# Altium schematic sheet 22_USB_CONNECTOR.SchDoc: USB-C Connector
size A; DocumentNumber: 11; SheetNumber: 11; SheetTotal: 12
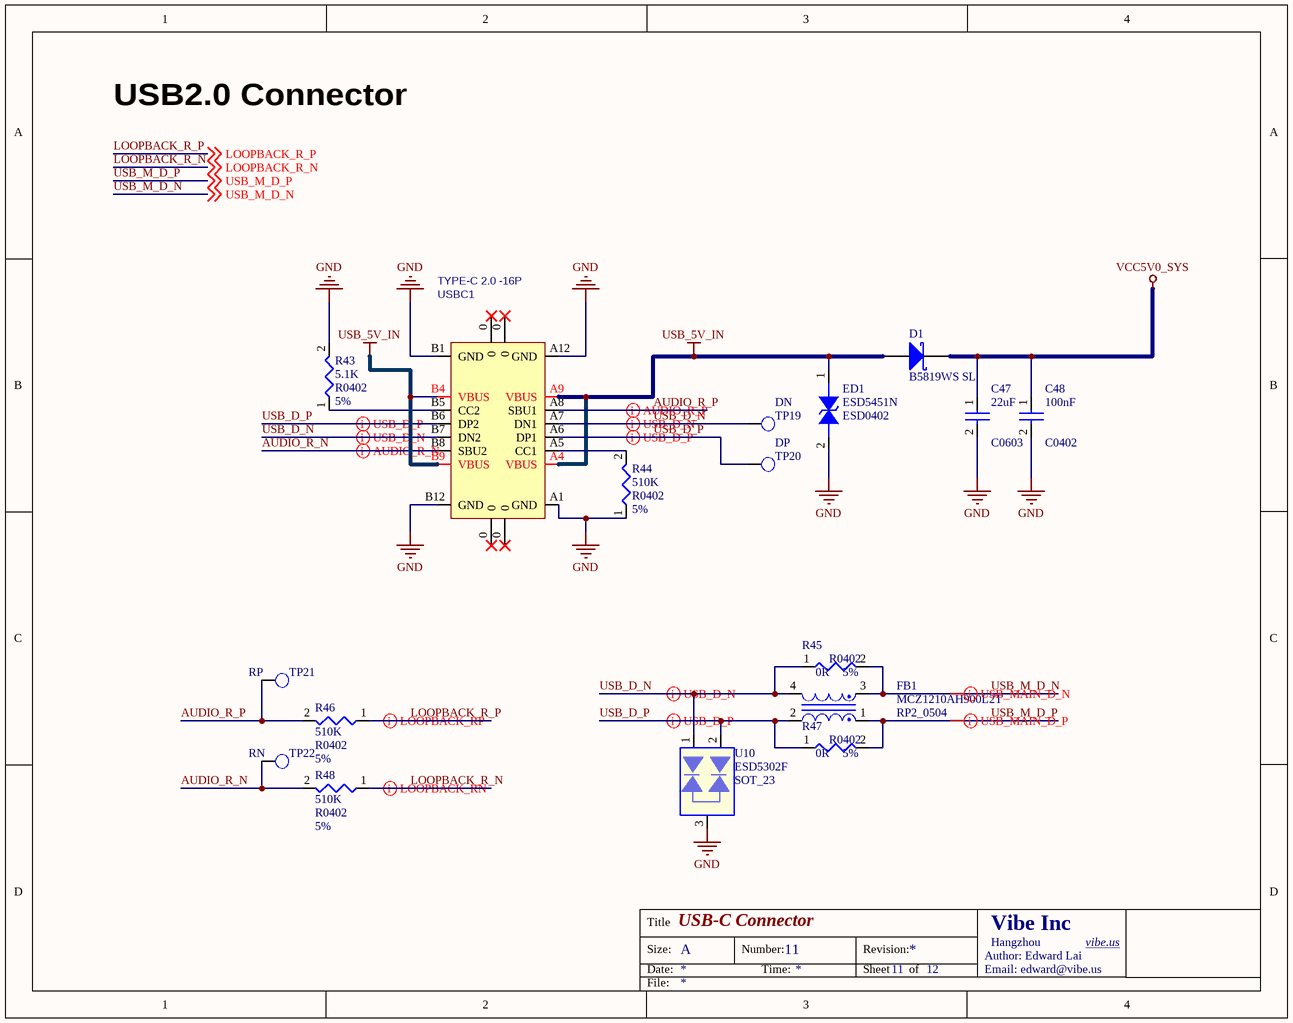
[diagram p0: 22_USB_CONNECTOR.SchDoc]

## Parts
C47  22uF  PCB Footprint: C0603  [C0603_L]
C48  100nF  PCB Footprint: C0402  [C0402_L]
D1  B5819WS SL  [SOD-323]
ED1  ESD5451N  [ESD0402]
FB1  MCZ1210AH900L2T  PCB Footprint: RP2_0504  [L0402D]  (net tie, no BOM)
R43  5.1K  Tolerance: 5%  [R0402]
R44  510K  Tolerance: 5%  [R0402]
R45  0R  Tolerance: 5%  [R0402]
R46  510K  Tolerance: 5%  [R0402]
R47  0R  Tolerance: 5%  [R0402]
R48  510K  Tolerance: 5%  [R0402]
TP19  DN  [TP_0R70]  (no BOM)
TP20  DP  [TP_0R70]  (no BOM)
TP21  RP  [TP_0R70]  (no BOM)
TP22  RN  [TP_0R70]  (no BOM)
U10  ESD5302F  PCB Footprint: SOT_23  [SOT23]
USBC1  TYPE-C 2.0 -16P  [USB-C-SMD_16P]

## Nets
GND: C47.2 C48.2 ED1.2 R43.2 R44.1 U10.3 USBC1.A1(GND) USBC1.A12(GND) USBC1.B1(GND) USBC1.B12(GND)
USB_5V_IN: D1.1(A) ED1.1 USBC1.A4(VBUS) USBC1.A9(VBUS) USBC1.B4(VBUS) USBC1.B9(VBUS)
VCC5V0_SYS: C47.1 C48.1 D1.2(K)
AUDIO_R_N: R48.2 TP22.1 USBC1.B8(SBU2)
AUDIO_R_P: R46.2 TP21.1 USBC1.A8(SBU1)
LOOPBACK_R_N: R48.1 ; off-sheet LOOPBACK_R_N
LOOPBACK_R_P: R46.1 ; off-sheet LOOPBACK_R_P
USB_D_N: FB1.4 R45.1 TP19.1 U10.1 USBC1.A7(DN1) USBC1.B7(DN2)
USB_D_P: FB1.2 R47.1 TP20.1 U10.2 USBC1.A6(DP1) USBC1.B6(DP2)
USB_M_D_N: FB1.3 R45.2 ; off-sheet USB_M_D_N
USB_M_D_P: FB1.1 R47.2 ; off-sheet USB_M_D_P
NetR43_1: R43.1 USBC1.B5(CC2)
NetR44_2: R44.2 USBC1.A5(CC1)

Not connected (* = marked no-connect by the designer): USBC1 0*

## Layout directives
differential pair; differential pair class AUDIO_IN; net class AUDIO_DIFF: AUDIO_R_N, AUDIO_R_P, LOOPBACK_R_N, LOOPBACK_R_P
differential pair; differential pair class USB; net class USB: USB_D_N, USB_D_P
differential pair; differential pair class USB: USB_D_N, USB_D_P, USB_M_D_N, USB_M_D_P

## Notes on the sheet
- USB2.0 Connector
- Title
- Size:
- Date:
- A
- Number:
- Time:
- Revision:
- Sheet
- of
- Author: Edward Lai
- Email: edward@vibe.us
- Vibe Inc
- Hangzhou
- vibe.us <http://vibe.us>
- File:

## Library data of the parts
C47 = CAP NP_Dup1: cap,22.00uF,+/-10%,10V,X5R,C0603; Priority: A; Part Type: C0603
C48 = CAP NP_Dup1: cap,100.00nF,+/-10%,10V,X5R,C0402; Priority: A; Part Type: C0402
D1 = SS14: B5819WS SL 肖特基二极管 / SOD-323; Part Type: SS14
ED1 = DIODE BI_DIR TRIG: 1-Line, Bi-directional, Transient Voltage Suppressors.17.5pF.; Priority: A; PCB Footprint: ESD0402; Part Type: ESD_TVS
FB1 = INDUCTOR COM: MCZ1210AH900L2T, 0603 90Ohm 100MHz; Priority: A; Part Type: BEAD
R43 = RESISTOR: 通用厚膜电阻,5.1K,+/-5%,R0402; Priority: A; PCB Footprint: R0402; Part Type: 通用厚膜电阻
R44 R46 R48 = RESISTOR: 通用厚膜电阻,510K,+/-1%,R0402; Priority: A; PCB Footprint: R0402; Part Type: 通用厚膜电阻
R45 R47 = RESISTOR: 通用厚膜电阻,0R,+/-5%,R0402; Priority: A; PCB Footprint: R0402; Part Type: 通用厚膜电阻
TP19-TP22 = TP: Test Point 0.7mm; PCB Footprint: TP_0R50; Priority: A; Part Type: TP
U10 = ESD_ESDA6V8UL: 2-Lines, Uni-directional,Ultra-low Capacitance.Transient Voltage Suppressors; Priority: A; Part Type: ESD_TVS
USBC1 = USB2.0_Type-C_16Pin: USB2.0_Type-C_16Pin母座